# Altium schematic sheet Mechanical.SchDoc
size A; SheetNumber: 2; SheetTotal: 3
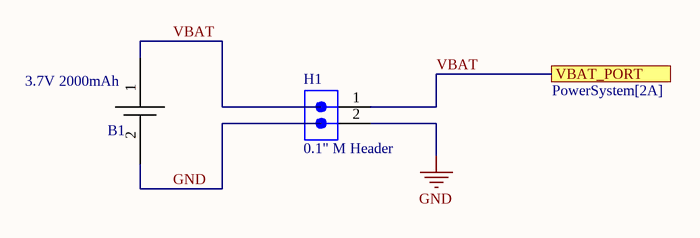
[diagram p0: Mechanical.SchDoc]

## Parts
B1  3.7V 2000mAh  [2_PIN_100MIL_BATTERY]
H1  0.1" M Header  [2_PIN_100MIL]

## Ports
VBAT_PORT (see PowerSystem[2A])

## Nets
GND: B1.2(Ground) H1.2
VBAT: B1.1(Power) H1.1 ; port VBAT_PORT

## Library data of the parts
B1 = 2011_Battery: Lithium Ion Battery - 3.7V 2000Mah Adafruit 2011; Manufacturer: Adafruit Industries; Manufacturer Part Number: 2011; Supplier: DigiKey; Supplier Part Number: 1528-1857-ND; Category: Batteries and Accessories; Stock: 51; Pricing: 1=12.5 (USD); RoHS: Non-Compliant; Schedule B: 8507600000|8507600000|8507600000|8507600000|8507600000
H1 = Battery_2Pin_100mil: CONN HEADER VERT 2POS 2.54MM; Manufacturer: Sullins; Manufacturer Part Number: PRPC002SAAN-RC; Connector Type: Header, Unshrouded, Breakaway; Number of Positions: 2; Number of Positions Loaded: All; Pitch: 0.100" (2.54mm); Online Catalog: 0.100" (2.54mm) Pitch Connector Headers; Other Names: S9510E-02  S9510E-02-ND; Supplier 1: Digi-Key; Stock 1: 42739; Pricing 1: 1=0.08, 10=0.073, 25=0.054, 50=0.0464, 100=0.0449, 250=0.0387, 500=0.0372 (USD); Standard Package: 1; Category: Connectors, Interconnects; Family: Rectangular Connectors - Headers, Male Pins; Series: -; Packaging: Bulk; Contact Type: Male Pin; Number of Rows: 1; Row Spacing: -; Contact Mating Length: 0.230" (5.84mm); Mounting Type: Through Hole; Termination: Solder; Fastening Type: -; Features: -; Contact Finish: Gold; Contact Finish Thickness: Flash; Color: Black; ComponentLink1URL: https://media.digikey.com/PDF/Data%20Sheets/Sullins%20PDFs/xRxCzzzSxxN-RC_ST_11635-B.pdf?src-supplier=Digi-Key; ComponentLink1Description: https://media.digikey.com/PDF/Data%20Sheets/Sullins%20PDFs/xRxCzzzSxxN-RC_ST_11635-B.pdf?src-supplier=Digi-Key; Supplier Part Number 1: S1011EC-02-ND